# Altium schematic sheet Main.SchDoc
size A4; SheetNumber: 1; SheetTotal: 8
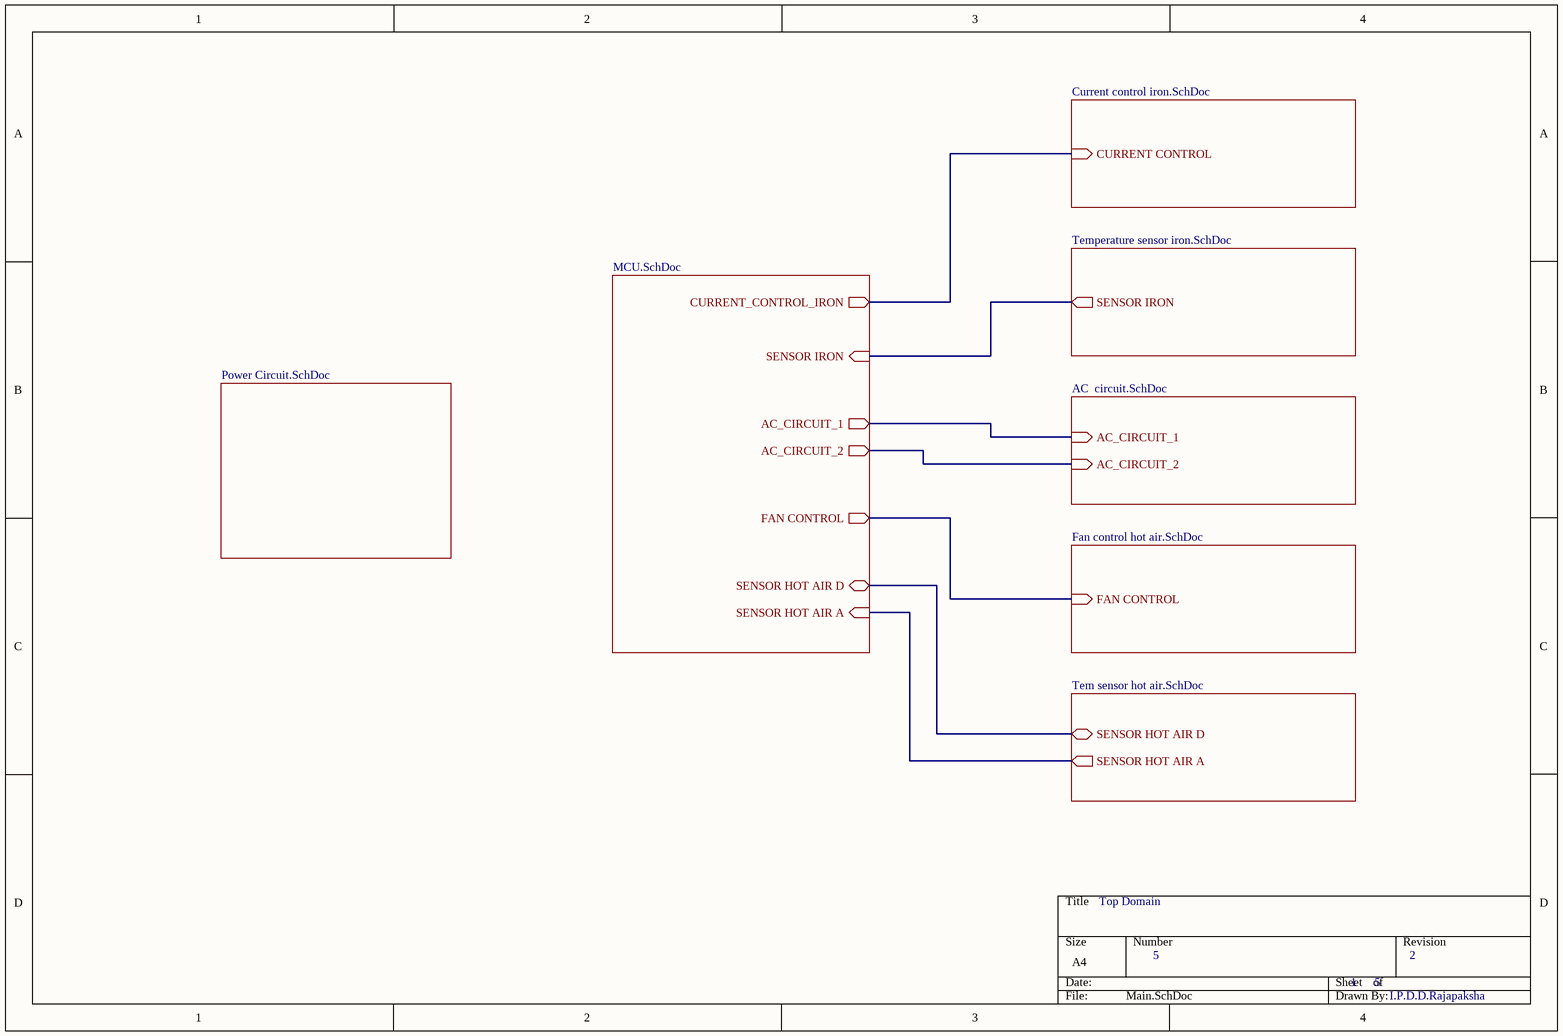
[diagram p0: Main.SchDoc]

## Sub-sheets
AC circuit = AC  circuit.SchDoc: AC_CIRCUIT_1 (in), AC_CIRCUIT_2 (in)
Current control iron = Current control iron.SchDoc: CURRENT CONTROL (in)
Fan control hot air = Fan control hot air.SchDoc: FAN CONTROL (in)
MCU = MCU.SchDoc: CURRENT_CONTROL_IRON (out), SENSOR IRON (in), FAN CONTROL (out), SENSOR HOT AIR A (in), SENSOR HOT AIR D (bidir), AC_CIRCUIT_1 (out), AC_CIRCUIT_2 (out)
Power Circuit = Power Circuit.SchDoc: no entries
Tem sensor hot air = Tem sensor hot air.SchDoc: SENSOR HOT AIR D (bidir), SENSOR HOT AIR A (out)
Temperature sensor = Temperature sensor iron.SchDoc: SENSOR IRON (out)

## Nets
(unnamed): sheet MCU/CURRENT_CONTROL_IRON, sheet Current control iron/CURRENT CONTROL
(unnamed): sheet MCU/SENSOR IRON, sheet Temperature sensor/SENSOR IRON
(unnamed): sheet MCU/FAN CONTROL, sheet Fan control hot air/FAN CONTROL
(unnamed): sheet MCU/SENSOR HOT AIR A, sheet Tem sensor hot air/SENSOR HOT AIR A
(unnamed): sheet MCU/SENSOR HOT AIR D, sheet Tem sensor hot air/SENSOR HOT AIR D
(unnamed): sheet MCU/AC_CIRCUIT_1, sheet AC circuit/AC_CIRCUIT_1
(unnamed): sheet MCU/AC_CIRCUIT_2, sheet AC circuit/AC_CIRCUIT_2

## Notes on the sheet
- Top Domain
- 5
- 1      5
- 2
- I.P.D.D.Rajapaksha